# EAGLE schematic lpc1347_refboard (EAGLE 6.4)
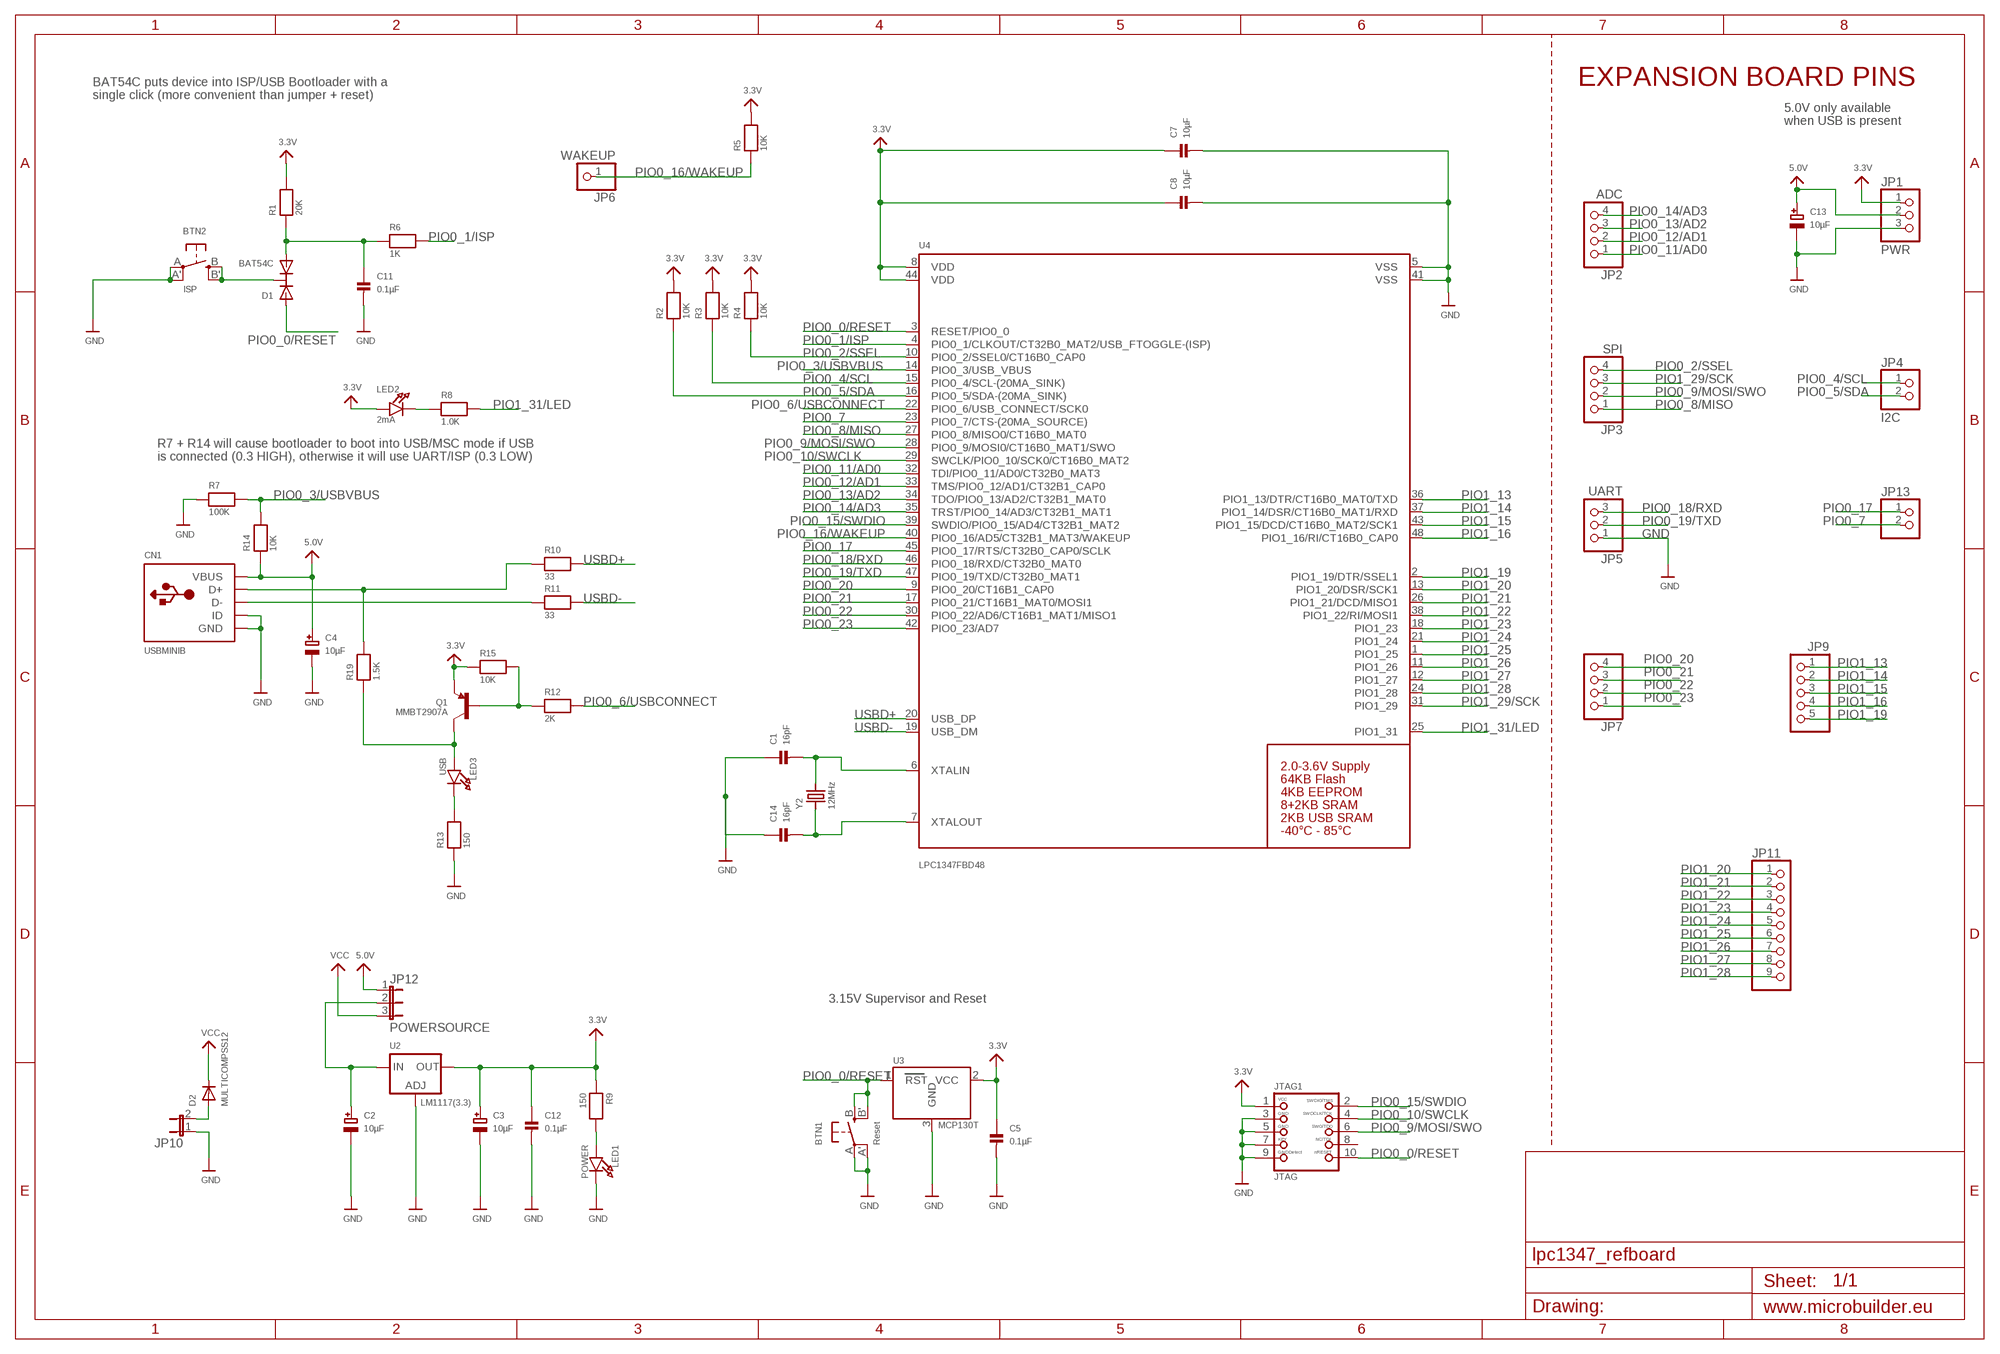
[diagram p0: schematic, sheet 1]

## Parts
BTN1  Reset  SWITCH_TACT_SMT  [EVQ-Q2]
BTN2  ISP  SWITCH_TACT_SMT  [EVQ-Q2]
C1  16pF  CAP_CERAMIC0603  [0603]
C2  10µF  CAP_TANTALUMA/3216_REFLOW  [EIA3216-18/A-R]
C3  10µF  CAP_TANTALUMA/3216_REFLOW  [EIA3216-18/A-R]
C4  10µF  CAP_TANTALUMA/3216_REFLOW  [EIA3216-18/A-R]
C5  0.1µF  CAP_CERAMIC0603  [0603]
C7  10µF  CAP_CERAMIC0805  [0805]
C8  10µF  CAP_CERAMIC0805  [0805]
C11  0.1µF  CAP_CERAMIC0603  [0603]
C12  0.1µF  CAP_CERAMIC0603  [0603]
C13  10µF  CAP_TANTALUMA/3216_REFLOW  [EIA3216-18/A-R]
C14  16pF  CAP_CERAMIC0603  [0603]
CN1  USBMINIB  [USB-MINIB]
D1  BAT54C  [SOT23-R]
D2  MULTICOMPSS12  DIODESMA  [SMADIODE]
JP1  PWR  HEADER-1X3ROUND  [1X03_ROUND]
JP2  ADC  HEADER-1X4ROUND  [1X04_ROUND]
JP3  SPI  HEADER-1X4ROUND  [1X04_ROUND]
JP4  I2C  HEADER-1X2ROUND  [1X02_ROUND]
JP5  UART  HEADER-1X3ROUND  [1X03_ROUND]
JP6  WAKEUP  HEADER-1X1ROUND  [1X01_ROUND]
JP7  HEADER-1X4ROUND  [1X04_ROUND]
JP9  HEADER-1X5ROUND  [1X05_ROUND]
JP10  JUMPER2  [JUMPER2]
JP11  HEADER-1X970MIL  [1X09_ROUND_70]
JP12  POWERSOURCE  JUMPER3  [JUMPER3]
JP13  HEADER-1X2ROUND  [1X02_ROUND]
JTAG1  JTAG  JTAG-CORTEXM3  [2X05_1.27MM_SMT]
LED1  POWER  LED0805  [CHIPLED_0805]
LED2  2mA  LED0805  [CHIPLED_0805]
LED3  USB  LED0805  [CHIPLED_0805]
Q1  MMBT2907A  TRANSISTOR_PNPSOT23-REFLOW  [SOT23-R]
R1  20K  RESISTOR0603  [0603]
R2  10K  RESISTOR0603  [0603]
R3  10K  RESISTOR0603  [0603]
R4  10K  RESISTOR0603  [0603]
R5  10K  RESISTOR0603  [0603]
R6  1K  RESISTOR0603  [0603]
R7  100K  RESISTOR0603  [0603]
R8  1.0K  RESISTOR0603  [0603]
R9  150  RESISTOR0603  [0603]
R10  33  RESISTOR0603  [0603]
R11  33  RESISTOR0603  [0603]
R12  2K  RESISTOR0603  [0603]
R13  150  RESISTOR0603  [0603]
R14  10K  RESISTOR0603  [0603]
R15  10K  RESISTOR0603  [0603]
R19  1.5K  RESISTOR0603  [0603]
U2  LM1117(3.3)  LM1117SOT223-REFLOW  [SOT223-R]
U3  MCP130T  MCP130TREFLOW  [SOT23-R]
U4  LPC1347FBD48  LPC1347_QFP48  [LQFP48]
Y2  12MHz  CRYSTALTHIN  [CRYSTAL_3.2X2.5]

## Nets
3.3V: C3.+ C5.1 C7.1 C8.1 C12.1 JP1.1 JTAG1.1 LED2.A Q1.2(E) R1.2 R2.2 R3.2 R4.2 R5.2 R9.1 R15.1 U2.2(OUT) U3.2(VCC) U4.8(VDD) U4.44(VDD)
5.0V: C4.+ C13.+ CN1.VBUS JP1.2 JP12.1 R14.1
GND: BTN1.A'(P1) BTN1.A(P) BTN2.A'(P1) BTN2.A(P) C1.1 C2.- C3.- C4.- C5.2 C7.2 C8.2 C11.2 C12.2 C13.- C14.1 CN1.GND CN1.ID JP1.3 JP5.1 JP10.1 JTAG1.3 JTAG1.5 JTAG1.7 JTAG1.9 LED1.C R7.1 R13.1 U2.1(ADJ) U3.3(GND) U4.5(VSS) U4.41(VSS)
N$1: LED2.C R8.1
N$2: C2.+ JP12.2 U2.3(IN)
N$4: D2.A JP10.2
N$5: BTN2.B'(S1) BTN2.B(S) D1.3(C)
N$7: CN1.D+ R10.1 R19.2
N$8: Q1.1(B) R12.1 R15.2
N$9: C11.1 D1.2(A2) R1.1 R6.1
N$10: LED1.A R9.2
N$11: LED3.C R13.2
N$12: CN1.D- R11.1
N$13: LED3.A Q1.3(C) R19.1
PIO0_0/RESET: BTN1.B'(S1) BTN1.B(S) D1.1(A1) JTAG1.10 U3.1(RST) U4.3(RESET/PIO0_0)
PIO0_1/ISP: R6.2 U4.4(PIO0_1/CLKOUT/CT32B0_MAT2/USB_FTOGGLE-(ISP))
PIO0_2/SSEL: JP3.4 R4.1 U4.10(PIO0_2/SSEL0/CT16B0_CAP0)
PIO0_3/USBVBUS: R7.2 R14.2 U4.14(PIO0_3/USB_VBUS)
PIO0_4/SCL: JP4.1 R3.1 U4.15(PIO0_4/SCL-(20MA_SINK))
PIO0_5/SDA: JP4.2 R2.1 U4.16(PIO0_5/SDA-(20MA_SINK))
PIO0_6/USBCONNECT: R12.2 U4.22(PIO0_6/USB_CONNECT/SCK0)
PIO0_7: JP13.2 U4.23(PIO0_7/CTS-(20MA_SOURCE))
PIO0_8/MISO: JP3.1 U4.27(PIO0_8/MISO0/CT16B0_MAT0)
PIO0_9/MOSI/SWO: JP3.2 JTAG1.6 U4.28(PIO0_9/MOSI0/CT16B0_MAT1/SWO)
PIO0_10/SWCLK: JTAG1.4 U4.29(SWCLK/PIO0_10/SCK0/CT16B0_MAT2)
PIO0_11/AD0: JP2.1 U4.32(TDI/PIO0_11/AD0/CT32B0_MAT3)
PIO0_12/AD1: JP2.2 U4.33(TMS/PIO0_12/AD1/CT32B1_CAP0)
PIO0_13/AD2: JP2.3 U4.34(TDO/PIO0_13/AD2/CT32B1_MAT0)
PIO0_14/AD3: JP2.4 U4.35(TRST/PIO0_14/AD3/CT32B1_MAT1)
PIO0_15/SWDIO: JTAG1.2 U4.39(SWDIO/PIO0_15/AD4/CT32B1_MAT2)
PIO0_16/WAKEUP: JP6.1 R5.1 U4.40(PIO0_16/AD5/CT32B1_MAT3/WAKEUP)
PIO0_17: JP13.1 U4.45(PIO0_17/RTS/CT32B0_CAP0/SCLK)
PIO0_18/RXD: JP5.3 U4.46(PIO0_18/RXD/CT32B0_MAT0)
PIO0_19/TXD: JP5.2 U4.47(PIO0_19/TXD/CT32B0_MAT1)
PIO0_20: JP7.4 U4.9(PIO0_20/CT16B1_CAP0)
PIO0_21: JP7.3 U4.17(PIO0_21/CT16B1_MAT0/MOSI1)
PIO0_22: JP7.2 U4.30(PIO0_22/AD6/CT16B1_MAT1/MISO1)
PIO0_23: JP7.1 U4.42(PIO0_23/AD7)
PIO1_13: JP9.1 U4.36(PIO1_13/DTR/CT16B0_MAT0/TXD)
PIO1_14: JP9.2 U4.37(PIO1_14/DSR/CT16B0_MAT1/RXD)
PIO1_15: JP9.3 U4.43(PIO1_15/DCD/CT16B0_MAT2/SCK1)
PIO1_16: JP9.4 U4.48(PIO1_16/RI/CT16B0_CAP0)
PIO1_19: JP9.5 U4.2(PIO1_19/DTR/SSEL1)
PIO1_20: JP11.1 U4.13(PIO1_20/DSR/SCK1)
PIO1_21: JP11.2 U4.26(PIO1_21/DCD/MISO1)
PIO1_22: JP11.3 U4.38(PIO1_22/RI/MOSI1)
PIO1_23: JP11.4 U4.18(PIO1_23)
PIO1_24: JP11.5 U4.21(PIO1_24)
PIO1_25: JP11.6 U4.1(PIO1_25)
PIO1_26: JP11.7 U4.11(PIO1_26)
PIO1_27: JP11.8 U4.12(PIO1_27)
PIO1_28: JP11.9 U4.24(PIO1_28)
PIO1_29/SCK: JP3.3 U4.31(PIO1_29)
PIO1_31/LED: R8.2 U4.25(PIO1_31)
USBD+: R10.2 U4.20(USB_DP)
USBD-: R11.2 U4.19(USB_DM)
VCC: D2.C JP12.3
XTALIN: C1.2 U4.6(XTALIN) Y2.2
XTALOUT: C14.2 U4.7(XTALOUT) Y2.1
Unconnected: JTAG1.8

## Notes on the sheet
- BAT54C puts device into ISP/USB Bootloader with a | EXPANSION BOARD PINS
- single click (more convenient than jumper + reset)
- 5.0V only available
- when USB is present
- R7 + R14 will cause bootloader to boot into USB/MSC mode if USB
- is connected (0.3 HIGH), otherwise it will use UART/ISP (0.3 LOW)
- 3.15V Supervisor and Reset

## Library data of the parts
BTN1 BTN2 = microbuilder (1):SWITCH_TACT_SMT: SMT Tact Switches 6x6mm - Digikey: P12940SCT-ND KMR2 (4.6x2.8mm) - Digikey: 401-1426-1-ND EVQ-PQHB55 - Light Touch, 160GF (4.5x4.5mm) - Digikey: P8090SCT-ND
C1 C5 C7 C8 C11 C12 C14 = microbuilder:CAP_CERAMIC: Ceramic Capacitors 0402 - 0402 Surface Mount Capacitors 16pF 50V 5% [Digikey: 445-4899-2-ND] 18pF 50V 5% [Digikey: 490-1281-2-ND] 22pF 50V 5% [Digikey: 490-1283-2-ND] 68pF 50V 5% [Digikey: 490-1289-2-ND] 0.1uF 10V 10% [Digikey: 490-1318-2-ND] 1.0uF 6.3V 10% [Digikey: 490-1320-2-ND] 0603 - 0603 Surface Mount Capacitors 16 pF 50V 5% [Digikey: 445-5051-2-ND] 22 pF 50V [Digikey: PCC220ACVTR-ND] 33 pF 50V 5% [Digikey: 490-1415-1-ND] 56pF 50V 5% [Digikey: 490-1421-1-ND] 220pF 50V 5% [Digikey: 445-1285-1-ND] 680 pF 50V 2200 pF 50V 5% C0G [Digikey: 445-1297-1-ND] 5600 pF 100V 5% X7R [Digikey: 478-3711-1-ND] 0.1 µF 25V 10% [Digikey: PCC2277TR-ND] 0.22 µF 16V 10% X7R [Digikey: 445-1318-1-ND] 1.0 µF 25V 10% [Digikey: 445-5146-2-ND] 0603 - RF Specific 3pF 250V +/-0.1pF RF [Digikey: 712-1347-1-ND] 18 pF 250V 5% [Digikey: 478-3505-1-ND or 712-1322-1-ND] 56 pF 250V 5% C0G RF [Digikey: 490-4867-1-ND] 68 pF 250V RF [Digikey: 490-4868-1-ND] 0805 - 0805 Surface Mount Capacitors 220 pF 250V 2% RF Ceramic Capacitor [Digikey: 712-1398-1-ND] 1000 pF 50V 2% NP0 Ceramic Capacitor [Digikey: 478-3760-1-ND] 0.1 µF 25V 10% Ceramic Capacitor [Digikey: PCC1828TR-ND] 1.0 µF 16V 10% Ceramic Capacitor[Digikey: 490-1691-2-ND] 10.0 µF 10V 10% Ceramic Capacitor[Digikey: 709-1228-1-ND] 10.0 uF 16V 10% Ceramic Capacitor [Digikey: 478-5165-2-ND] 47 uF 6.3V 20% Ceramic Capacitor [Digikey: 587-1779-1-ND or 399-5506-1-ND] 1206 - 1206 Surface Mount Capacitors 47uF 10V 20% Ceramic Capacitor [Digikey: 490-5528-1-ND or 399-5508-1-ND or 445-6010-1-ND] 100uF 6.3V -20%, +80% Y5V Ceramic Capacitor (Digikey: 490-4512-1-ND, Mouser: 81-GRM31CF50J107ZE1L)
C2-C4 C13 = microbuilder:CAP_TANTALUM: Tantalum Capacitors Wave footprints have larger pads and are meant to be used for hand soldering. Reflow footprints are optimised for solder paste and a reflow oven. EIA3216-18/A-[R/W] - Size A / 3216-18 / 1206 footprint 4.7µF 25V 10% Tantalum Capacitor 10µF 16V 10% Tantalum Capacitor [Digikey: 495-2236-2-ND] EIA3528-21/B-[R/W] - Size B / 3528-21 47µF 10V 10% Tantalum Capactior [Digikey: 495-2216-1-ND] EIA6032-28/C-[R/W] - Size C / 6032-28 10µF 35V 20% Tantalum Capacitor [Digikey: 495-2285-1-ND] 100µF 16V 10% Tantalum Capactior [Digikey: 399-5214-1-ND]
CN1 = microbuilder:USB: USB Connectors USBMINIB - Surface Mount Female Mini-B USB Connector 4UConnector: 06564
D1 = microbuilder:BAT54C: BAT54C Schottky Diodes (Common Cathode) Vf: 800mV, 30V 200mA Digikey: BAT54CFSCT-ND For 300mA see BAT54CFILM: Vf: 900mV, 40V 300mA Digkey: 497-3786-2-ND
D2 = microbuilder:DIODE: Diode SMA Model Volts Amps Type Vf Vr Digikey # Notes SSA34-E3 40V 3A Schottky 480mV @ 3A 200uA @ 40V SSA34-E3/61TGITR-ND CDBA120-G 20V 1A Schottky 500mV @ 1A 500uA @ 20V 641-1014-6-ND REEL MBRA210 10V 2A Schottky 350mV @ 2A 700uA @ 10V MBRA210LT3 SOD-123 Model Volts Amps Type Vf Vr Order # Notes BAT54T1G 30V 200mA Schottky 800mV @ 200mA 2uA @ 25V BAT54T1GOSTR-ND B0530W 30V 500mA Schottky 430mV @ 500mA 130uA @ 30V B0530W-FDICT-ND REEL MBR120 1A 20V Schottky 340mV @ 1A MBR120VLSFT1GOSCT-ND SOD-323 Model Volts Amps Type Vf Vr Order # Notes PMEG2005EJ 20V 500mA Schottky 355mV @ 500mA 568-4110-1-ND ZLLS410 10V 570mA Schottky 380mV @ 570mA ZLLS410CT-ND 1N4148WS 75V 150mA Silicon/Simple 1V 1N4148WSFSCT-ND REEL SOD-523 Model Volts Amps Type Vf Vr Order # Notes BAT54XV2 30V 200mA Schottky 0.8V @ 100mA BAT54XV2CT-ND TB751S 30V 30mA Schottky RB751S-40TE61CT-ND SOT23-R/W (R = Solder Paste/Reflow Ovens, W = Hand-Soldering) Model Volts Amps Type Vf Vr Order # Notes BAT54FILM 40V 300mA Schottky 497-7162-1-ND
JP1 = microbuilder:HEADER-1X3: PIN HEADER
JP2 JP3 JP7 = microbuilder (1):HEADER-1X4: PIN HEADER
JP4 JP13 = microbuilder (1):HEADER-1X2: PIN HEADER
JP5 = microbuilder (1):HEADER-1X3: PIN HEADER
JP6 = microbuilder:HEADER-1X1: PIN HEADER
JP9 = microbuilder (1):HEADER-1X5: PIN HEADER
JP10 = microbuilder (1):JUMPER2: JUMPER - 2 Pins
JP11 = microbuilder (1):HEADER-1X9: PIN HEADER
JP12 = microbuilder:JUMPER3: JUMPER - 3 Pins
JTAG1 = microbuilder:JTAG-CORTEXM3: Serial Wire (SW-DP) Connector This standard 0.05" 10-pin connector is for use with the Cortex M0/M3's native SWD (serial wire debugger) interface (SW-DP). Some boards support a 20-pin combined JTAG+SWD connector (SWJ-DP), such as the LPC1700 family, but many smaller devices only work with SWD which typically use the smaller 10-pin SW-DP connecter (the LPC1300 family, for example, only supports SWD). 2x05 1.27mm/0.05" Connector: This is the standard SMT connector defined by ARM for all Cortex devices, and should be used in most situations and for forward-compatibility since any new devices coming to market will likely use this connector. MOLEX 10 Pin 0.1" Connector: This 0.1" 10 pin connector has the same pin layout as the standard 0.05" connector, but is easier to work with if you are using standard jumper wires or custom cables to connect your SWD hardware. MOLEX 20 Pin 0.1" Connector: This 0.1" 20 pin connector is the same model used for ARM7/ARM9 JTAG debuggers, but is connected to match the pins on the Segger J-Link for ARM (which supports both JTAG and SWD debugging). See the following document from ARM for more information on Cortex M3 Debug Connectors: http://infocenter.arm.com/help/topic/com.arm.doc.faqs/attached/13634/cortex_debug_connectors.pdf And the following page for an overview with images of the different connector types: http://www.keil.com/peripherals/coresight/connectors.asp
LED1-LED3 = microbuilder:LED: LED 0603 - 0603 Surface Mount Package 2mA: Green LED - Low Power (3.9mcd, 2ma, 1.7Vf) - Digikey: 475-2709-2-ND Orange LED - Low Power (9.8mcd, 2ma, 1.8Vf) - Digikey: 475-1194-2-ND Red LED - Low Power (5mcd, 2ma, 1.8Vf) - Digikey: 475-1195-2-ND Yellow LED - Low Power (7mcd, 2ma, 1.8Vf) - Digikey: 475-1196-2-ND 5mA: Blue LED - Low Power (17mcd, 5ma, 2.9Vf) - Digikey: LNJ937W8CRACT-ND 0805 - 0805 Surface Mount Package 2mA: Red LED (8.8mcd, 2mA, 1.8Vf, Clear) - Low Power [Digikey: 475-2510-1-ND] Green LED (5mcd, 2mA, 1.8Vf, Clear) - Low Power [Digikey: 475-2730-1-ND] Yellow LED (11.3mcd, 2mA, 1.8Vf, Clear) - Low Power [Digikey: 475-2555-1-ND] 20mA: Red LED (104mcd, 20mA, Diffused) - LS R976 [Digikey: 475-1278-6-ND] Red LED (12mcd, 20mA, 2.0Vf, Clear) - APT2012EC [Digikey: 754-1128-1-ND] Green LED (15mcd, 20mA, 2.2Vf, Clear) - APT2012GC [Digikey: 754-1131-1-ND] Orange LED (160mcd, 20mA, 2.1Vf, Clear) - APT2012SECK [Digikey: 754-1130-1-ND] 1206 - 1206 Surface Mount Package Green LED (26mcd, 20mA, Diffused) - LG N971 [Digikey: 475-1407-6-ND] Red LED (15mcd, 20mA, Diffused) - LH N974 [Digikey: 475-1416-6-ND]
Q1 = microbuilder:TRANSISTOR_PNP: PNP Transistor Transistor (PNP) 800mA 60V, 1.6V VCE @ 500mA [Digikey: MMBT2907AFSTR-ND] Transistor (PNP) Low Sat - 1.5A 20V, 260mV VCE @ 400mA [Digikey: ZXTP25020DFLTR-ND] SOT23-R - SOT23 footprint optimised for use with solder paste and reflow ovens. SOT23-W - SOT23 footprint optimised for hand-soldering (larger pads).
R1-R15 R19 = microbuilder:RESISTOR: Resistors 0402 - 0402 Surface Mount Package 22 Ohm 1% 1/16W [Digikey: 311-22.0LRTR-ND] 33 Ohm 5% 1/16W 1.0K 5% 1/16W 1.5K 5% 1/16W 2.0K 1% 1/16W 10.0K 1% 1/16W [Digikey: 311-10.0KLRTR-ND] 10.0K 5% 1/16W [Digikey: RMCF0402JT10K0TR-ND] 12.1K 1% 1/16W [Digikey: 311-22.0LRTR-ND] 100.0K 5% 1/16W 0603 - 0603 Surface Mount Package 0 Ohm 1/10 Watt 1% Resistor 15 Ohm 1/10 Watt 1% Resistor 33 Ohm 1/10 Watt 1% Resistor 49.9 Ohm 1/10 Watt 1% Resistor 100 Ohm 1/10 Watt 1% Resistor 150 Ohm 1/10 Watt 1% Resistor 240 Ohm 1/10 Watt 1% Resistor 390 Ohm 1/10 Watt 1% Resistor 560 Ohm 1/10 Watt 1% Resistor 680 Ohm 1/10 Watt 1% Resistor 750 Ohm 1/10 Watt 1% Resistor 1.0K Ohm 1/10 Watt 1% Resistor 1.5K Ohm 1/10 Watt 1% Resistor 2.0K Ohm 1/10 Watt 1% Resistor 2.2K Ohm 1/10 Watt 1% Resistor 3.3K Ohm 1/10 Watt 1% Resistor 4.7K Ohm 1/10 Watt 1% Resistor 10.0K Ohm 1/10 Watt 1% Resistor 12.0K Ohm 1/10 Watt 1% Resistor 12.1K Ohm 1/10 Watt 1% Resistor 20.0K Ohm 1/10 Watt 1% Resistor 33.0K Ohm 1/10 Watt 1% Resistor 100.0K Ohm 1/10 Watt 1% Resistor 0805 - 0805 Surface Mount Package 0 Ohm 1/8 Watt 1% Resistor 33 Ohm 1/8 Watt 1% Resistor 100 Ohm 1/8 Watt 1% Resistor 150 Ohm 1/8 Watt 1% Resistor 200 Ohm 1/8 Watt 1% Resistor 240 Ohm 1/8 Watt 1% Resistor 330 Ohm 1/8 Watt 1% Resistor 390 Ohm 1/8 Watt 1% Resistor 470 Ohm 1/8 Watt 1% Resistor 1.0K Ohm 1/8 Watt 1% Resistor 1.5K Ohm 1/8 Watt 1% Resistor 2.0K Ohm 1/8 Watt 1% Resistor 4.7K Ohm 1/8 Watt 1% Resistor 5.1K Ohm 1/8 Watt 1% Resistor 5.6K Ohm 1/8 Watt 1% Resistor 10.0K Ohm 1/8 Watt 1% Resistor 22.0K Ohm 1/8 Watt 1% Resistor 33.0K Ohm 1/8 Watt 1% Resistor 100K Ohm 1/8 Watt 1% Resistor 1206 - 1206 Surface Mount Package 2012 - 2010 Surface Mount Package 0.11 Ohm 1/2 Watt 1% Resistor - Digikey: RHM.11UCT-ND
U2 = microbuilder:LM1117: LM1117 Voltage Regulator LM1117 Adjustable Voltage regulator [Digikey: LM1117IMP-ADJDKR-ND] LM1117 3.3V Voltage regulator [AP1117E33GDIDKR-ND] LM1117 5.0V Voltage regulator [AP1117E50GDIDKR-ND] SOT223-REFLOW - SOT223 package for solder paste/reflow ovens SOT223-WAVE - SOT223 package for hand-soldering (larger pads) Note: For the fixed-voltage regulators, simply set the ADJ pin to GND.
U3 = microbuilder:MCP130T: MCP130T Voltage Supervisor (Active Low) Voltage supervisors will put the MCU in a reset state if the voltage drops below a pre-determined level. SOT23-R/SOT23-W: Voltage Supervisor - 3.15V Active Low Note: Use the "Reflow" footprint when working with solder paste, and the "Wave" footprint when soldering by hand with a soldering iron (the latter has larger pads that are easier to solder by hand). Digikey: MCP130T-315I/TTCT-ND
U4 = microbuilder (1):LPC1347_QFP48: LPC1347 - ARM Cortex M3 72MHz MCU Supply: 2.0-3.6V 12-bit 500kHz ADC Flash: 64KB EEPROM: 4KB SRAM: 8KB SRAM0 + 2KB SRAM1 + 2KB USB Temp: -40°C - 85°C
Y2 = microbuilder:CRYSTAL: Crystals HC49UP - Surface Mount Crystal 4.0MHz 18pF +/-30ppm Surface Mount Crystal [Digikey: 535-9857-1-ND] 12.0 MHz Surface Mount Crystal [Digikey: 535-9869-6-ND] 25.0 MHz Surface Mount Crystal [Digikey: 535-9078-1-ND] 2.5 x 2.0mm - MEMs SMT Crystal 16.0 MHz 10pF 20ppm 2.5 x 2.0mm Crystal [Digikey -40-85°C: 535-10923-1-ND] 3.2 x 2.5mm - MEMs SMT Crystal 12.0 MHz 8pF 15ppm 3.2 x 2.5mm Crystal [Digikey: -10-70°C: 644-1047-1-ND -40-125°C: 644-1128-1-ND] 16.0 MHz 8pF 15ppm 3.2 x 2.5mm Crystal [Digikey: -10-70°C: 644-1049-1-ND -40-125°C: 644-1129-2-ND] 16.0 MHz 10pF 10ppm 3.2 x 2.5mm Crystal [Digikey: 644-1100-1-ND] 27.12 MHz 18pF 30ppm 3.2 x 2.5mm Crystal [Digikey: 887-1424-1-ND] 27.12MHz 10pF 10ppm 3.2 x 2.5mm Crystal [Digikey: 887-1329-1-ND] 4.9 x 1.8mm - MEMs SMT Crystal 32.768 KHz 12.5pF 20ppm 4.9 x 1.8mm Crystal [Digikey: SE2415CT-ND] 8.0 x 3.8mm - Surface Mount Crystal 32.768kHz 12.5pF 20ppm -40°C-85°C [Digikey: 535-9166-2-ND] Cylinder 32.768KHz Cylinder Crystal (2x6mm body) [Ex. Digikey: 300-8341-2-ND]